# EasyEDA Pro project OURphone_PCB_2026-01-30.epro, board Bachup
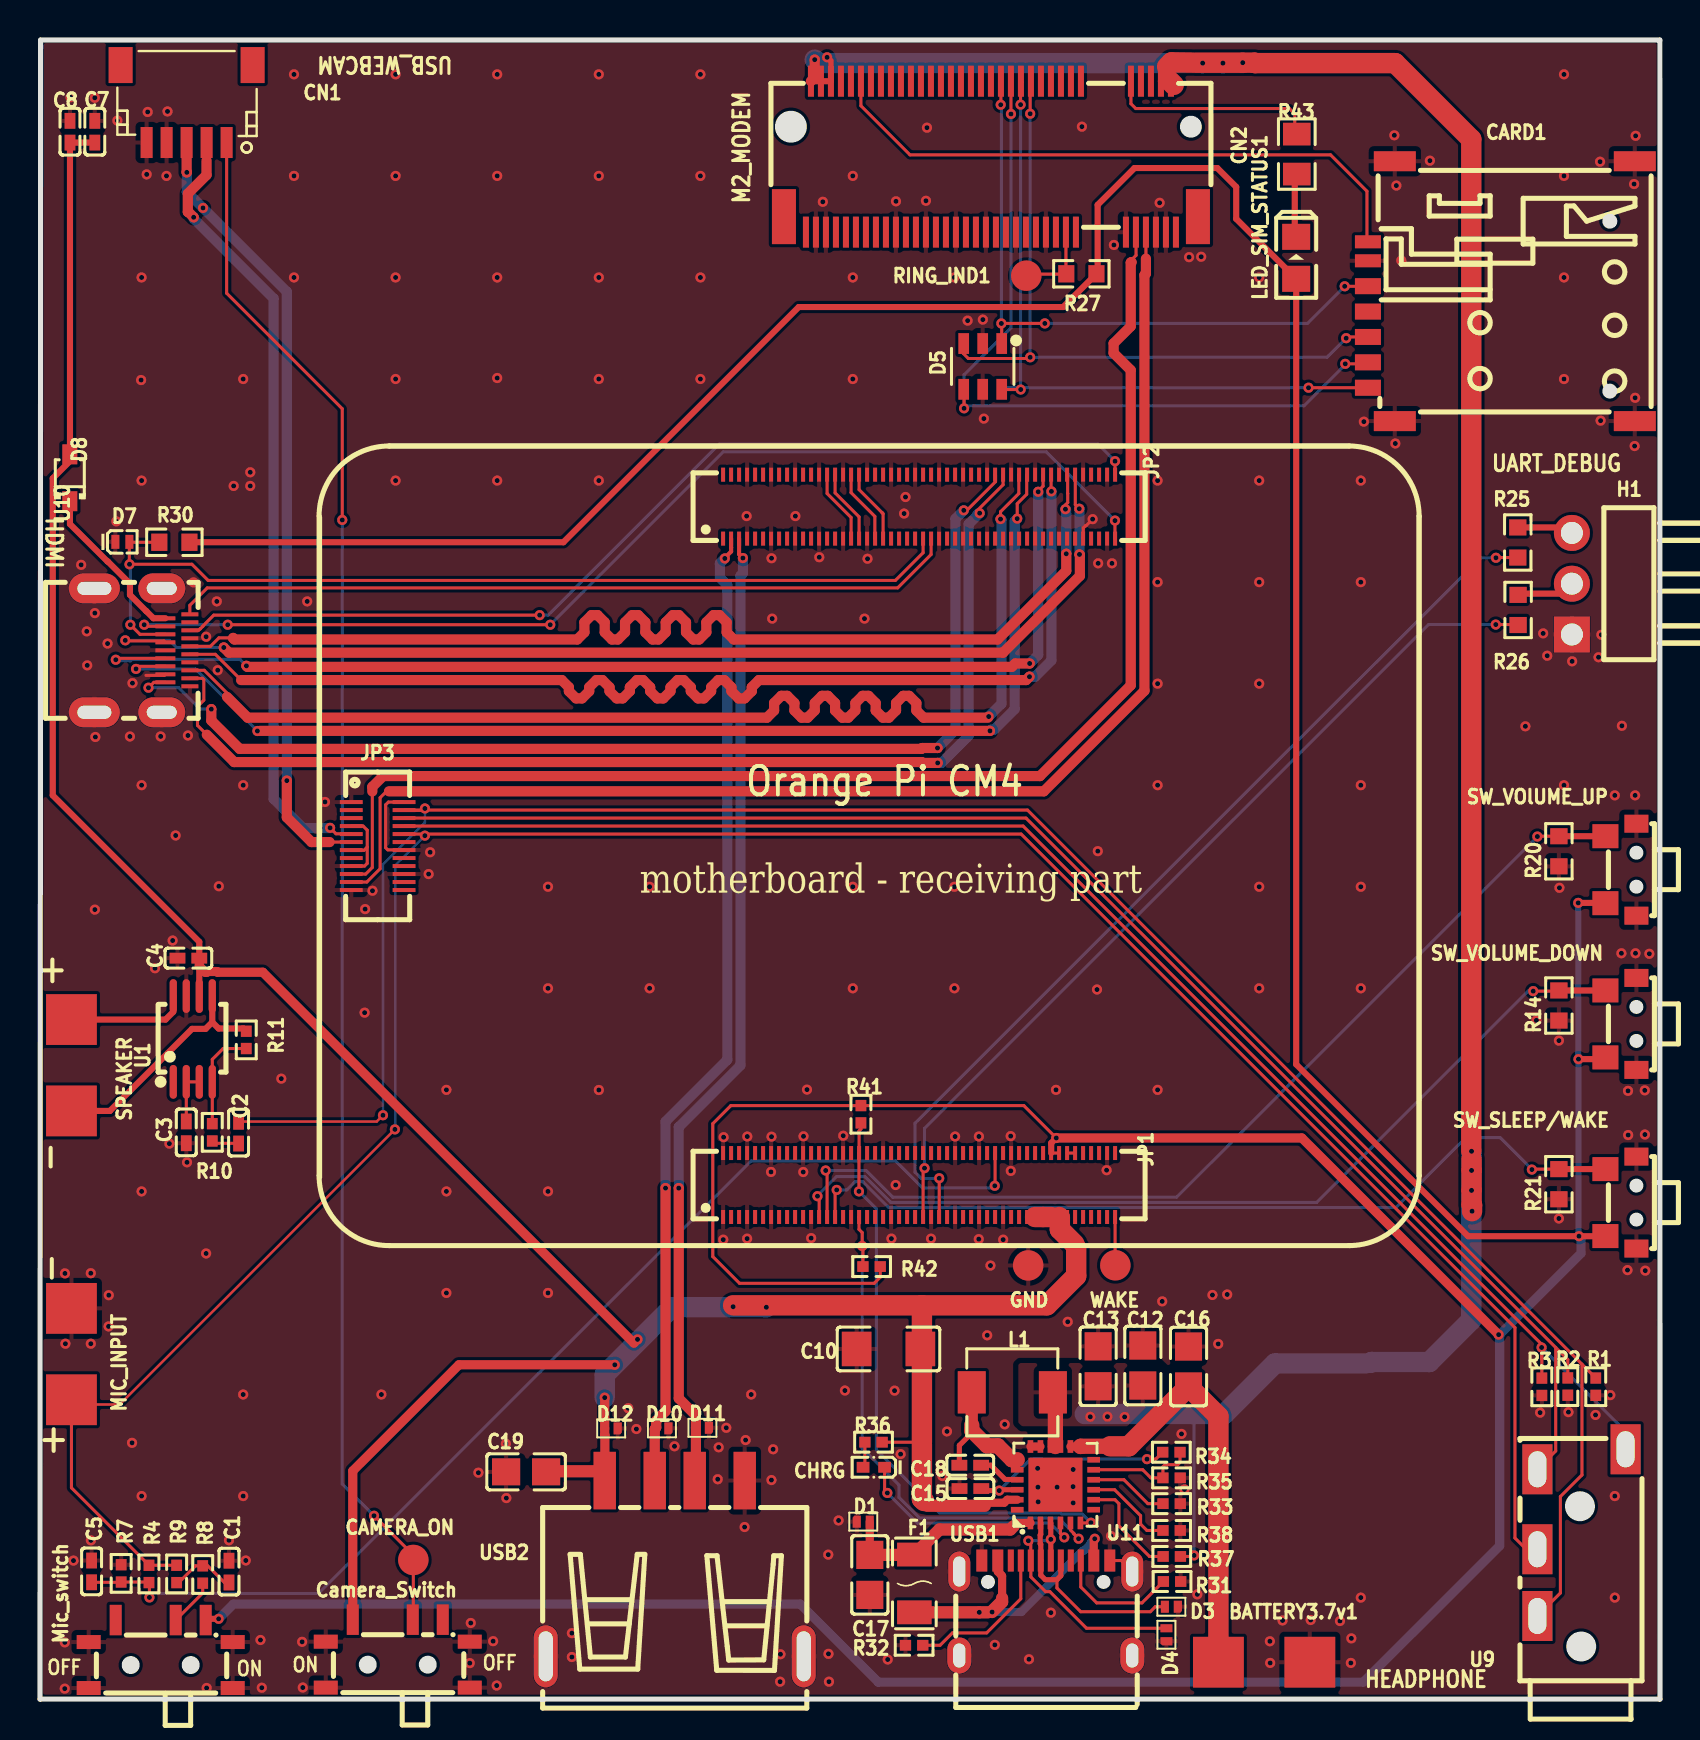
[diagram p6: board, top side]
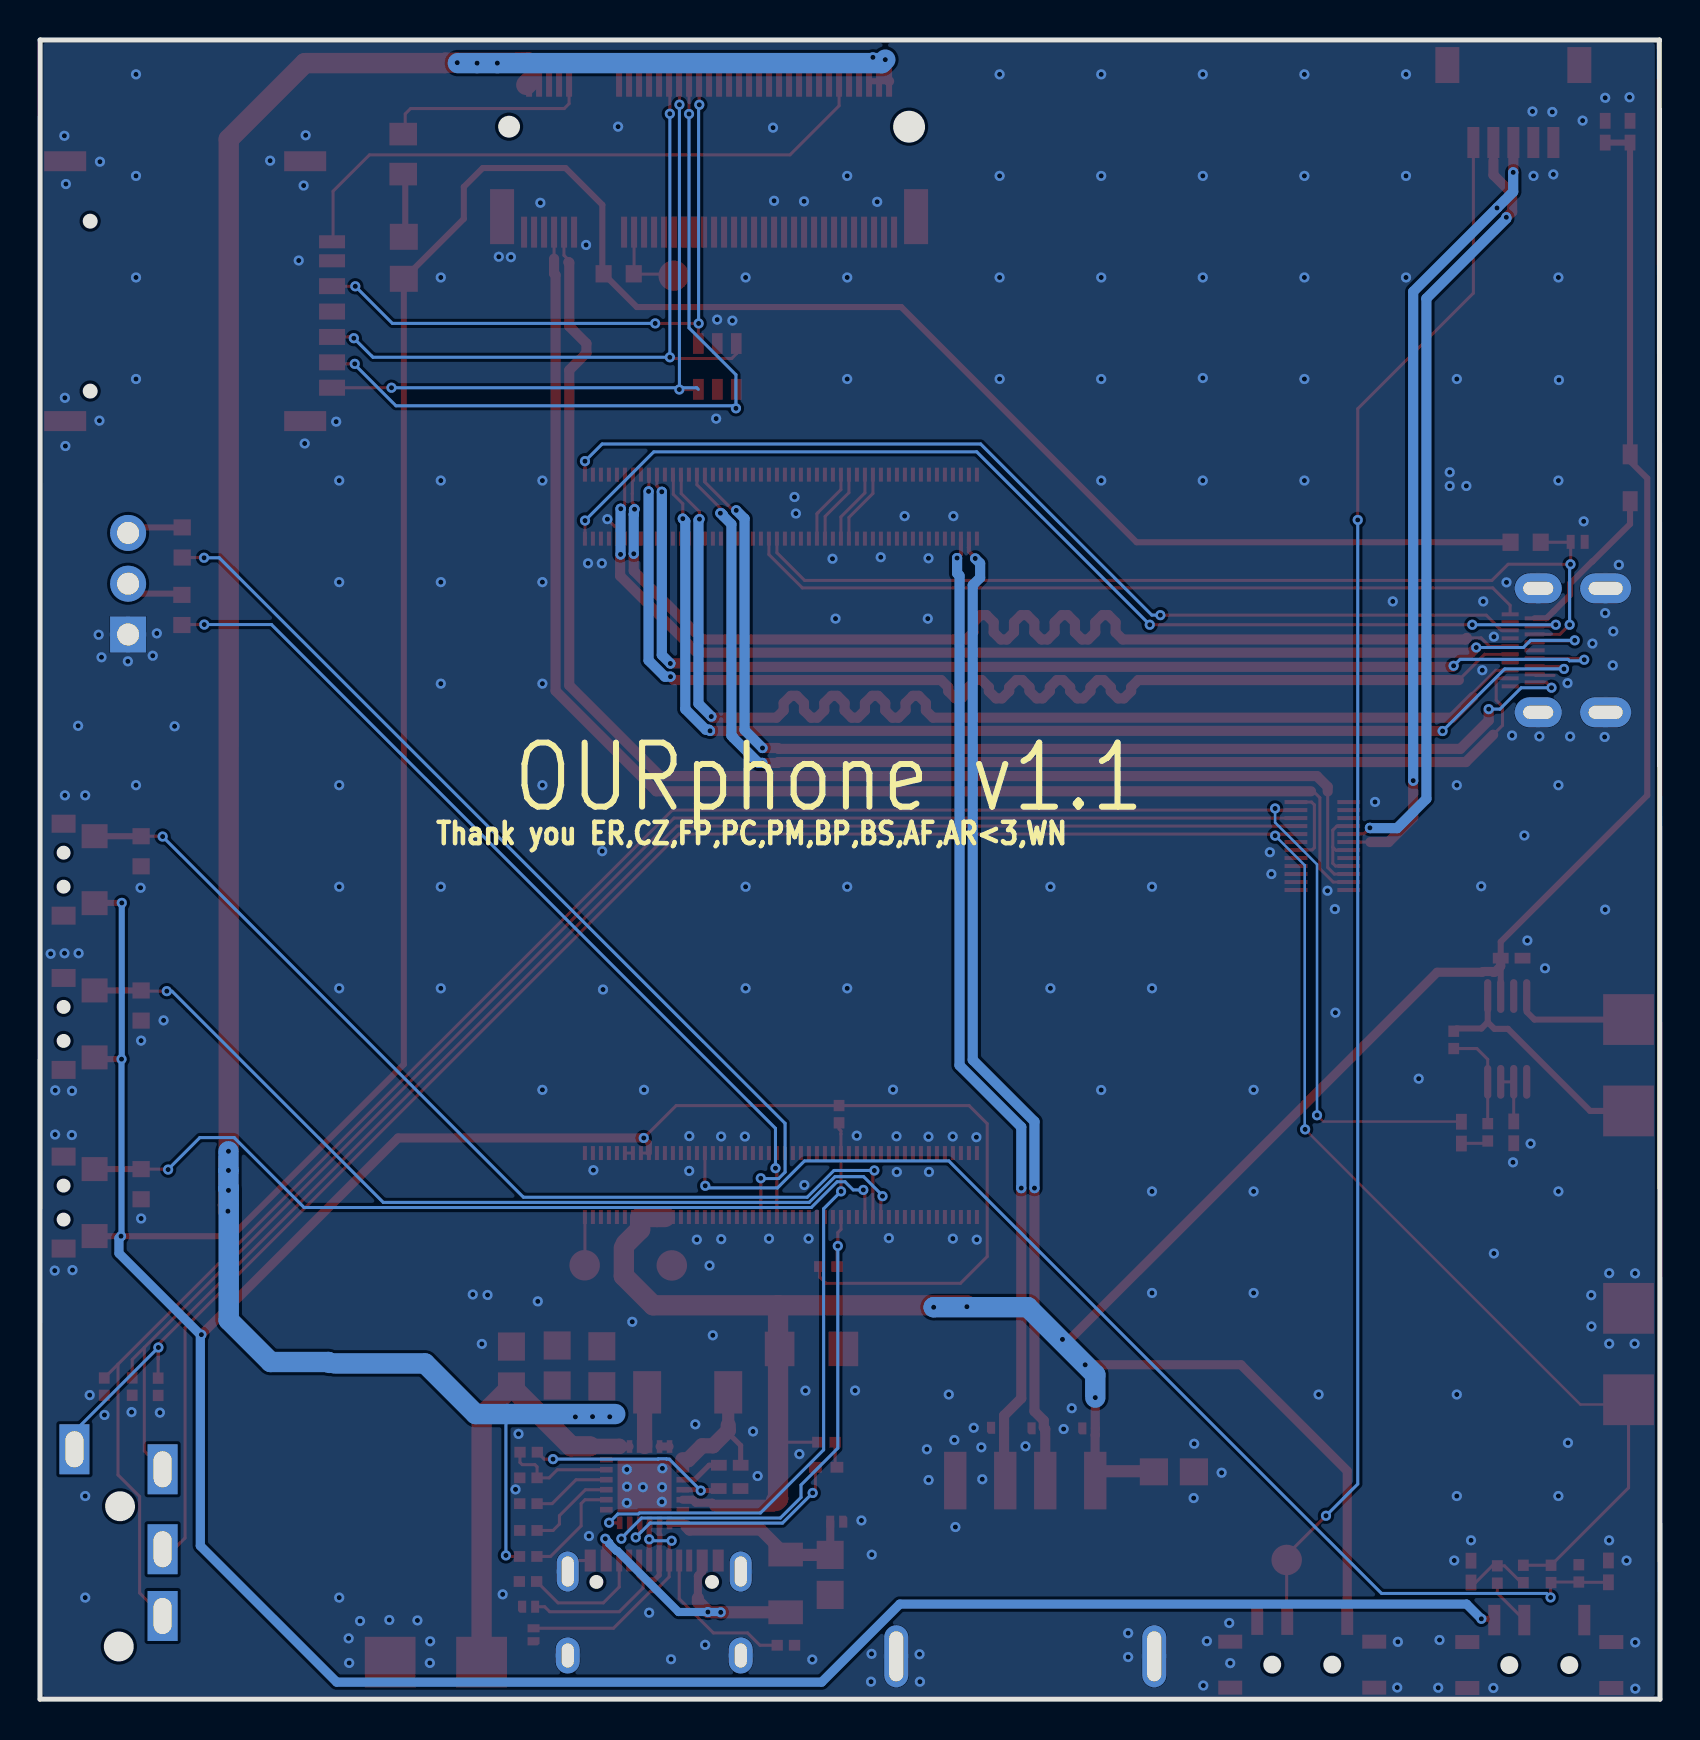
[diagram p7: board, bottom side, seen from below]

Outline 81 x 83 mm; copper layers: Top Layer, Bottom Layer. Coordinates in mm from the lower left corner of the outline.
Outline path: 0,0 0.03,83 80.99,83 81,0 0,0
Stack: Top Layer 0.035mm / Dielectric1 1.51mm FR4 er 4.5 / Bottom Layer 0.035mm

## Design rules (mm)
net USB2_HOST2_P: DP6
net USB2_HOST2_N: DP6
net USB2_DP: USB2_D
net USB2_DN: USB2_D
net HDMI_TX2_P: DP4
net HDMI_TX2_N: DP4
net HDMI_TX1_P: DP3
net HDMI_TX1_N: DP3
net HDMI_TX0_P: DP1
net HDMI_TX0_N: DP1
net HDMI_TXCLK_P: DP2
net HDMI_TXCLK_N: DP2
net USB3_HOST1_P: DP5
net USB3_HOST1_N: DP5
net USB2_HOST3_P: DP7
net USB2_HOST3_N: DP7
net MIPI_CSI_RX_D2N: MIPI_CSI_RX_D2
net MIPI_CSI_RX_D2P: MIPI_CSI_RX_D2
net MIPI_CSI_RX_D3N: MIPI_CSI_RX_D3
net MIPI_CSI_RX_D3P: MIPI_CSI_RX_D3
net USB2_0_OTG_DM: DP8
net USB2_0_OTG_DP: DP8
template: User Custom Config
spacing Default (default): track to track 0.102, other pairs 0 to 0.152
track width Default (default): min 0.051, default 0.152, max 1.27
differential pair Default (default): width min 0.152, default 0.508, max 0.762; gap min 0.152, default 0.152
via Default (default): diameter min 0.178, default 0.762, max 100.025; hole min 0.15, default 0.61, max 59.995
pour e4504 uses copperRegion1

## Placement (name value [footprint] x y rotation side)
BATTERY3.7v1  NOB  [BATTERY SYMBOL]  64.76 0.71 0 top
C1  10uF  [C0402]  9.45 6.38 270 top
C2  390nF  [C0402]  9.93 28.34 270 top
C3  1uF  [C0402]  7.31 28.35 90 top
C4  1uF  [C0402]  7.42 37.07 0 top
C5  100nF  [C0402]  2.58 6.39 270 top
C7  100nF  [C0402]  2.74 78.41 90 top
C8  10uF  [C0402]  1.5 78.41 270 top
C10  100uF  [C1206]  42.43 17.52 0 top
C12  22uF  [C0805]  55.14 16.69 270 top
C13  22uF  [C0805]  52.91 16.65 270 top
C15  10uF  [C0402]  46.52 10.54 0 top
C16  22uF  [C0805]  57.43 16.64 270 top
C17  2.2uF  [C0805]  41.49 6.22 90 top
C18  100nF  [C0402]  46.51 11.7 0 top
C19  2.2uF  [C0805]  24.31 11.37 0 top
CAMERA_ON  TP-橘色测试点  [TESTPOINT-TH_BD3.2]  18.67 6.96 180 top
Camera_Switch  HX MSK12C02-HB  [SW-SMD_MSK12C02-HB]  17.89 2.28 0 top
CARD1  SMN-303  [SIM-SMD_SMN-303]  73.07 70.43 90 top
CHRG  XL-1005UGC  [LED0402-RD_GREEN]  41.69 11.6 180 top
CN1  SM05B-SRSS-TB (LF)(SN)  [CONN-SMD_SM05B-SRSS-TB-LF-SN]  7.33 79.81 180 top
CN2  AS0BC21-S30BB-7H  [CONN-SMD_AS0BC21-S30BB-7H]  47.55 77.16 180 top
D1  AZ5825-01F  [DFN-2L_L1.0-W0.6-P0.65-BI]  41.16 8.88 0 top
D3  AZ5825-01F  [DFN-2L_L1.0-W0.6-P0.65-BI]  56.57 4.62 180 top
D4  AZ5825-01F  [DFN-2L_L1.0-W0.6-P0.65-BI]  56.32 3.22 90 top
D5  DT1042-04SO-7  [SOT-26_L3.0-W1.6-P0.95-LS2.8-BL]  47.14 66.67 180 top
D7  PESD5V0S1UL,315  [SOD-882_L1.0-W0.6-RD]  4.12 57.89 0 top
D8  1N5819WS  [SOD-323_L1.8-W1.3-LS2.5-RD]  1.49 61.1 90 top
D10  AZ5825-01F  [DFN-2L_L1.0-W0.6-P0.65-BI]  31.1 13.55 180 top
D11  AZ5825-01F  [DFN-2L_L1.0-W0.6-P0.65-BI]  33.12 13.57 180 top
D12  AZ5825-01F  [DFN-2L_L1.0-W0.6-P0.65-BI]  28.56 13.54 180 top
F1  SMD1206P250TF  [F1206]  43.72 5.79 90 top
GND  TP-橘色测试点  [TESTPOINT-TH_BD3.2]  49.41 21.7 0 top
H1  PZ254R-11-03P  [HDR-TH_3P-P2.54-H-M-W10.4]  76.59 55.8 90 top
JP1  DF40C-100DS-0.4V(51)  [CONN-SMD_DF40C-100DS-0.4V-51]  43.95 25.72 180 top
JP2  DF40C-100DS-0.4V(51)  [CONN-SMD_DF40C-100DS-0.4V-51]  43.95 59.66 180 top
JP3  DF40C-24DS-0.4V(51)  [CONN-SMD_DF40C-24DS-0.4V51]  16.88 42.68 90 top
L1  2.2uH  [IND-SMD_L4.4-W4.2]  48.62 15.35 180 top
LED_SIM_STATUS1  LED-0805_B  [LED0805_BLUE]  62.81 72.1 90 top
MIC_INPUT  NOB  [BATTERY SYMBOL]  2.72 20.82 90 top
Mic_switch  HX MSK12C02-HB  [SW-SMD_MSK12C02-HB]  6.03 2.26 0 top
R1  470Ω  [R0402]  77.79 15.63 90 top
R2  470Ω  [R0402]  76.39 15.64 90 top
R3  0Ω  [R0402]  75.09 15.63 90 top
R4  100kΩ  [R0402]  5.45 6.26 270 top
R7  100kΩ  [R0402]  4.06 6.29 270 top
R8  22Ω  [R0402]  8.14 6.24 270 top
R9  2.2kΩ  [R0402]  6.83 6.26 270 top
R10  20kΩ  [R0402]  8.61 28.35 90 top
R11  20kΩ  [R0402]  10.31 32.98 270 top
R14  10K  [R0603]  75.94 34.7 90 top
R20  10K  [R0603]  75.94 42.42 90 top
R21  10K  [R0603]  75.94 25.76 90 top
R25  1kΩ  [R0603]  73.89 57.86 90 top
R26  1kΩ  [R0603]  73.9 54.49 90 top
R27  10K  [R0603]  52.07 71.3 180 top
R30  10K  [R0603]  6.72 57.87 0 top
R31  5.1kΩ  [R0402]  56.6 5.88 180 top
R32  5.1kΩ  [R0402]  43.71 2.69 0 top
R33  270Ω  [R0402]  56.58 9.78 180 top
R34  10kΩ  [R0402]  56.57 12.35 180 top
R35  10kΩ  [R0402]  56.58 11.07 180 top
R36  2.2kΩ  [R0402]  41.68 12.85 0 top
R37  10kΩ  [R0402]  56.59 7.14 180 top
R38  100kΩ  [R0402]  56.58 8.44 0 top
R41  10kΩ  [R0402]  41.05 29.26 90 top
R42  10kΩ  [R0402]  41.58 21.64 0 top
R43  330Ω  [R0805]  62.84 77.29 270 top
RING_IND1  TP-橘色测试点  [TESTPOINT-TH_BD3.2]  49.31 71.21 180 top
SPEAKER  NOB  [BATTERY SYMBOL]  0.43 28.16 270 top
SW_SLEEP/WAKE  TS24CA  [SW-SMD_TS24CA]  79.05 24.84 270 top
SW_VOLUME_DOWN  TS24CA  [SW-SMD_TS24CA]  79.05 33.78 270 top
SW_VOlUME_UP  TS24CA  [SW-SMD_TS24CA]  79.05 41.49 270 top
U1  LM4990MM/NOPB  [MSOP-8_L3.0-W3.0-P0.65-LS5.0-BL]  7.64 33.03 0 top
U9  PJ-3200B-4A  [AUDIO-TH_PJ-3200B-4A]  77.07 8.33 90 top
U10  GT-HD004A-PNNG0  [HDMI-SMD_GT-HD004A-FNNG0]  5.11 52.47 270 top
U11  BQ25895RTWR  [QFN-24_L4.0-W4.0-P0.50-TL-EP2.7]  50.77 10.73 90 top
USB1  TYPE-C 16PIN 2MD(073)  [USB-C-SMD_TYPE-C-6PIN-2MD-073]  50.29 4.56 0 top
USB2  10.0 QHHTZB6.3  [USB-A-TH_10.0QHHTZB6.3]  31.74 6.54 0 top
WAKE  TP-橘色测试点  [TESTPOINT-TH_BD3.2]  53.77 21.7 0 top

## Footprints (pads in the part's own frame, mm; a bottom-side part is the same pattern mirrored in y, then rotated)
AUDIO-TH_PJ-3200B-4A
  rect 2.5x1.5 hole 1.8x0.9: 1(4.17,-2.204) 2(3.17,2.204) 3(-4.17,2.204) 4(-0.831,2.204)
BATTERY SYMBOL
  rect 2.54x2.54 smd: 1(-5.842,1.143) 2(-1.27,1.143)
C0402
  rect 0.79x0.54 smd: 1(-0.545,0) 2(0.545,0)
C0805
  rect 1.41x1.35 smd: 1(-1,0) 2(1,0)
C1206
  rect 1.485x1.728 smd: 1(-1.593,0) 2(1.593,0)
CONN-SMD_AS0BC21-S30BB-7H
  rect 0.3x1.55 smd: 1(-9.25,3.775) 2(-9,-3.775) 3(-8.75,3.775) 4(-8.5,-3.775) 5(-8.25,3.775) 6(-8,-3.775) 7(-7.75,3.775) 8(-7.5,-3.775) 9(-7.25,3.775) 10(-7,-3.775) 11(-6.75,3.775) 20(-4.5,-3.775) 21(-4.25,3.775) 22(-4,-3.775) 23(-3.75,3.775) 24(-3.5,-3.775) 25(-3.25,3.775) 26(-3,-3.775) 27(-2.75,3.775) 28(-2.5,-3.775) 29(-2.25,3.775) 30(-2,-3.775) 31(-1.75,3.775) 32(-1.5,-3.775) 33(-1.25,3.775) 34(-1,-3.775) 35(-0.75,3.775) 36(-0.5,-3.775) 37(-0.25,3.775) 38(0,-3.775) 39(0.25,3.775) 40(0.5,-3.775) 41(0.75,3.775) 42(1,-3.775) 43(1.25,3.775) 44(1.5,-3.775) 45(1.75,3.775) 46(2,-3.775) 47(2.25,3.775) 48(2.5,-3.775) 49(2.75,3.775) 50(3,-3.775) 51(3.25,3.775) 52(3.5,-3.775) 53(3.75,3.775) 54(4,-3.775) 55(4.25,3.775) 56(4.5,-3.775) 57(4.75,3.775) 58(5,-3.775) 59(5.25,3.775) 60(5.5,-3.775) 61(5.75,3.775) 62(6,-3.775) 63(6.25,3.775) 64(6.5,-3.775) 65(6.75,3.775) 66(7,-3.775) 67(7.25,3.775) 68(7.5,-3.775) 69(7.75,3.775) 70(8,-3.775) 71(8.25,3.775) 72(8.5,-3.775) 73(8.75,3.775) 74(9,-3.775) 75(9.25,3.775)
  rect 1.2x2.75 smd: 76(10.35,3) 77(-10.35,3)
CONN-SMD_DF40C-24DS-0.4V51
  rect 0.2x1.14 smd: 1(2.2,1.32) 2(2.2,-1.32) 3(1.8,1.32) 4(1.8,-1.32) 5(1.4,1.32) 6(1.4,-1.32) 7(1,1.32) 8(1,-1.32) 9(0.6,1.32) 10(0.6,-1.32) 11(0.2,1.32) 12(0.2,-1.32) 13(-0.2,1.32) 14(-0.2,-1.32) 15(-0.6,1.32) 16(-0.6,-1.32) 17(-1,1.32) 18(-1,-1.32) 19(-1.4,1.32) 20(-1.4,-1.32) 21(-1.8,1.32) 22(-1.8,-1.32) 23(-2.2,1.32) 24(-2.2,-1.32)
CONN-SMD_DF40C-100DS-0.4V-51
  rect 0.2x0.7 smd: 1(9.8,1.6) 2(9.8,-1.6) 3(9.4,1.6) 4(9.4,-1.6) 5(9,1.6) 6(9,-1.6) 7(8.6,1.6) 8(8.6,-1.6) 9(8.2,1.6) 10(8.2,-1.6) 11(7.8,1.6) 12(7.8,-1.6) 13(7.4,1.6) 14(7.4,-1.6) 15(7,1.6) 16(7,-1.6) 17(6.6,1.6) 18(6.6,-1.6) 19(6.2,1.6) 20(6.2,-1.6) 21(5.8,1.6) 22(5.8,-1.6) 23(5.4,1.6) 24(5.4,-1.6) 25(5,1.6) 26(5,-1.6) 27(4.6,1.6) 28(4.6,-1.6) 29(4.2,1.6) 30(4.2,-1.6) 31(3.8,1.6) 32(3.8,-1.6) 33(3.4,1.6) 34(3.4,-1.6) 35(3,1.6) 36(3,-1.6) 37(2.6,1.6) 38(2.6,-1.6) 39(2.2,1.6) 40(2.2,-1.6) 41(1.8,1.6) 42(1.8,-1.6) 43(1.4,1.6) 44(1.4,-1.6) 45(1,1.6) 46(1,-1.6) 47(0.6,1.6) 48(0.6,-1.6) 49(0.2,1.6) 50(0.2,-1.6) 51(-0.2,1.6) 52(-0.2,-1.6) 53(-0.6,1.6) 54(-0.6,-1.6) 55(-1,1.6) 56(-1,-1.6) 57(-1.4,1.6) 58(-1.4,-1.6) 59(-1.8,1.6) 60(-1.8,-1.6) 61(-2.2,1.6) 62(-2.2,-1.6) 63(-2.6,1.6) 64(-2.6,-1.6) 65(-3,1.6) 66(-3,-1.6) 67(-3.4,1.6) 68(-3.4,-1.6) 69(-3.8,1.6) 70(-3.8,-1.6) 71(-4.2,1.6) 72(-4.2,-1.6) 73(-4.6,1.6) 74(-4.6,-1.6) 75(-5,1.6) 76(-5,-1.6) 77(-5.4,1.6) 78(-5.4,-1.6) 79(-5.8,1.6) 80(-5.8,-1.6) 81(-6.2,1.6) 82(-6.2,-1.6) 83(-6.6,1.6) 84(-6.6,-1.6) 85(-7,1.6) 86(-7,-1.6) 87(-7.4,1.6) 88(-7.4,-1.6) 89(-7.8,1.6) 90(-7.8,-1.6) 91(-8.2,1.6) 92(-8.2,-1.6) 93(-8.6,1.6) 94(-8.6,-1.6) 95(-9,1.6) 96(-9,-1.6) 97(-9.4,1.6) 98(-9.4,-1.6) 99(-9.8,1.6) 100(-9.8,-1.6)
CONN-SMD_SM05B-SRSS-TB-LF-SN
  rect 0.6x1.55 smd: 1(-2,1.938) 2(-0.999,1.938) 3(0.001,1.938) 4(1,1.938) 5(2.001,1.938)
  rect 1.2x1.8 smd: 6(-3.3,-1.938) 7(3.3,-1.938)
DFN-2L_L1.0-W0.6-P0.65-BI
  custom 0.41x0.6 smd: 1(-0.325,0)
  rect 0.4x0.6 smd: 2(0.325,0)
F1206
  rect 1.19x1.728 smd: 1(-1.445,0) 2(1.445,0)
HDMI-SMD_GT-HD004A-FNNG0
  rect 0.2x0.85 smd: 1(1.8,2.388) 3(1.4,2.388) 5(1,2.388) 7(0.6,2.388) 9(0.2,2.388) 11(-0.2,2.388) 13(-0.6,2.388) 15(-1,2.388) 17(-1.4,2.388) 19(-1.8,2.388)
  rect 0.2x1 smd: 2(1.6,1.163) 4(1.2,1.163) 6(0.8,1.163) 8(0.4,1.163) 10(0,1.163) 12(-0.4,1.163) 14(-0.8,1.163) 16(-1.2,1.163) 18(-1.6,1.163)
  oval 1.5x2.35 hole 0.65x1.5: 20(-3.1,0.983) 20(3.1,0.983)
  oval 1.5x2.55 hole 0.65x1.7: 21(-3.1,-2.388) 21(3.1,-2.388)
HDR-TH_3P-P2.54-H-M-W10.4
  rect 1.8x1.8 hole 1.1: 1(-2.54,0)
  round 1.8 hole 1.1: 2(0,0) 3(2.54,0)
IND-SMD_L4.4-W4.2
  rect 1.4x2.12 smd: 1(2.028,0) 2(-2.028,0)
LED0402-RD_GREEN
  rect 0.636x0.54 smd: 1(-0.538,0) 2(0.538,0)
LED0805_BLUE
  rect 1.3x1.399 smd: 1(-1.05,0) 2(1.05,0)
MSOP-8_L3.0-W3.0-P0.65-LS5.0-BL
  oval 0.364x1.692 smd: 1(-0.975,-2.146) 2(-0.325,-2.146) 3(0.325,-2.146) 4(0.975,-2.146) 5(0.975,2.146) 6(0.325,2.146) 7(-0.325,2.146) 8(-0.975,2.146)
QFN-24_L4.0-W4.0-P0.50-TL-EP2.7
  rect 0.633x0.28 smd: 1(-1.911,1.25) 2(-1.911,0.75) 3(-1.911,0.25) 4(-1.911,-0.25) 5(-1.911,-0.75) 6(-1.911,-1.25) 13(1.911,-1.25) 14(1.911,-0.75) 15(1.911,-0.25) 16(1.911,0.25) 17(1.911,0.75) 18(1.911,1.25)
  rect 0.28x0.633 smd: 7(-1.25,-1.911) 8(-0.75,-1.911) 9(-0.25,-1.911) 10(0.25,-1.911) 11(0.75,-1.911) 12(1.25,-1.911) 19(1.25,1.911) 20(0.75,1.911) 21(0.25,1.911) 22(-0.25,1.911) 23(-0.75,1.911) 24(-1.25,1.911)
  rect 2.7x2.7 smd: 25(0,0)
R0402
  rect 0.566x0.54 smd: 1(-0.433,0) 2(0.433,0)
R0603
  rect 0.806x0.864 smd: 1(-0.753,0) 2(0.753,0)
R0805
  rect 1.133x1.377 smd: 1(-1,0) 2(1,0)
SIM-SMD_SMN-303
  rect 1x2.1 smd: 8(-6.5,5.328) 9(6.5,5.328) 10(6.5,-6.672) 11(-6.5,-6.672)
  rect 0.8x1.3 smd: C1(0.25,6.672) C2(-2.29,6.672) C3(-4.83,6.672) C6(-1.02,6.672) C7(-3.56,6.672)
  rect 0.65x1.3 smd: C5(1.52,6.672) CD(2.47,6.672)
SOD-323_L1.8-W1.3-LS2.5-RD
  rect 1x0.75 smd: 1(-1.173,0) 2(1.173,0)
SOD-882_L1.0-W0.6-RD
  rect 0.4x0.7 smd: 1(-0.35,0) 2(0.35,0)
SOT-26_L3.0-W1.6-P0.95-LS2.8-BL
  rect 0.532x1.04 smd: 1(-0.95,-1.145) 2(0,-1.145) 3(0.95,-1.145) 4(0.95,1.145) 5(0,1.145) 6(-0.95,1.145)
SW-SMD_MSK12C02-HB
  rect 0.6x1.524 smd: 1(-2.25,1.7) 2(0.75,1.7) 3(2.25,1.7)
  rect 1.2x0.7 smd: 4(-3.6,0.6) 4(-3.6,-1.7) 4(3.6,0.6) 4(3.6,-1.7)
SW-SMD_TS24CA
  rect 0.9x1.2 smd: 1(-2.3,0.775) 2(2.3,0.775)
  rect 1.2x1.3 smd: 3(-1.675,-0.775) 4(1.675,-0.775)
TESTPOINT-TH_BD3.2
  round 1.524 smd: 1(0,0)
USB-A-TH_10.0QHHTZB6.3
  rect 1.12x2.88 smd: 1(-3.5,4.395) 2(-1,4.395) 3(1,4.395) 4(3.5,4.395)
  oval 1.2x3.1 hole 0.7x2.5: 5(-6.45,-4.395) 6(6.45,-4.395)
USB-C-SMD_TYPE-C-6PIN-2MD-073
  rect 0.55x1.1 smd: 1(-3.2,2.375) 2(-2.4,2.375) 11(2.4,2.375) 12(3.2,2.375)
  rect 0.3x1.1 smd: 3(-1.75,2.375) 4(-1.25,2.375) 5(-0.75,2.375) 6(-0.25,2.375) 7(0.25,2.375) 8(0.75,2.375) 9(1.25,2.375) 10(1.75,2.375)
  oval 1.1x2 hole 0.6x1.5: 13(-4.325,1.825) 14(4.325,1.825)
  oval 1.2x1.8 hole 0.6x1.2: 13(-4.325,-2.375) 14(4.325,-2.375)

## Nets
+5V: C4.2 C7.1 C8.2 C10.2 C19.2 Camera_Switch.1 D8.2 D12.2 JP1.77 JP1.79 JP1.81 JP1.83 JP1.85 JP1.87 R36.2 U1.6 U11.23 USB2.1
GND: BATTERY3.7v1.2 C1.1 C3.1 C4.1 C5.1 C7.2 C8.1 C10.1 C12.1 C13.1 C15.1 C16.1 C17.1 C19.1 Camera_Switch.4 CARD1.8 CARD1.9 CARD1.10 CARD1.11 CARD1.C5 CN1.4 CN1.5 CN2.3 CN2.5 CN2.11 CN2.27 CN2.33 CN2.39 CN2.45 CN2.51 CN2.57 CN2.71 CN2.73 D1.1 D3.1 D4.1 D5.2 D5.5 D7.1 D10.1 D11.1 D12.1 GND.1 H1.1 JP1.1 JP1.2 JP1.7 JP1.8 JP1.13 JP1.14 JP1.22 JP1.23 JP1.32 JP1.33 JP1.42 JP1.43 JP1.52 JP1.53 JP1.59 JP1.60 JP1.65 JP1.66 JP1.71 JP1.74 JP1.98 JP2.7 JP2.8 JP2.13 JP2.14 JP2.19 JP2.20 JP2.25 JP2.26 JP2.31 JP2.32 JP2.37 JP2.38 JP2.44 JP2.50 JP2.55 JP2.56 JP2.61 JP2.62 JP2.67 JP2.68 JP2.73 JP2.74 JP2.79 JP2.80 JP2.85 JP2.86 JP2.91 JP2.92 JP2.97 JP2.98 JP3.1 JP3.2 JP3.7 JP3.13 JP3.14 JP3.17 JP3.20 JP3.23 MIC_INPUT.2 Mic_switch.4 R1.1 R2.1 R3.1 R7.1 R14.1 R20.1 R21.1 R31.1 R32.1 R33.1 R35.1 R38.2 SW_SLEEP/WAKE.1 SW_SLEEP/WAKE.2 SW_VOLUME_DOWN.1 SW_VOLUME_DOWN.2 SW_VOlUME_UP.1 SW_VOlUME_UP.2 U1.7 U10.1 U10.4 U10.7 U10.10 U10.13 U10.20 U10.21 U11.17 U11.18 U11.25 USB1.1 USB1.12 USB1.13 USB1.14 USB2.4 USB2.5 USB2.6
VBAT: BATTERY3.7v1.1 C16.2 U11.13 U11.14
VCC_1V8: JP1.88 JP1.90
VCC_3V3: JP1.84 JP1.86 LED_SIM_STATUS1.1 Mic_switch.3 R27.1 R30.2 R41.2 R42.2 SW_SLEEP/WAKE.4 SW_VOLUME_DOWN.4 SW_VOlUME_UP.4
BTST: C18.2 U11.21
CARD_DETECT: CARD1.CD CN2.64
CE: R38.1 U11.9
GPIO0_D0(UART2_RX_M0): JP1.51 R26.1
GPIO0_D1(UART2_TX_M0): JP1.55 R25.1
GPIO3_D1: JP1.25 R14.2 SW_VOLUME_DOWN.3
GPIO3_D2: JP1.27 R20.2 SW_VOlUME_UP.3
GPIO3_D5: JP1.29 R21.2 SW_SLEEP/WAKE.3
HDMI_CEC_PORT: D7.2 JP2.51 R30.1 U10.14
HDMI_TX0_N: JP2.84 U10.9
HDMI_TX0_P: JP2.82 U10.8
HDMI_TX1_N: JP2.78 U10.6
HDMI_TX1_P: JP2.76 U10.5
HDMI_TX2_N: JP2.72 U10.3
HDMI_TX2_P: JP2.70 U10.2
HDMI_TX_HPD_PORT: JP2.53 U10.19
HDMI_TXCLK_N: JP2.90 U10.12
HDMI_TXCLK_P: JP2.88 U10.11
HDMI_TXDDC_SCL_PORT: JP2.100 U10.15
HDMI_TXDDC_SDA_PORT: JP2.99 U10.16
HP_SNS: JP3.8 R3.2 U9.1
HPL_OUT: JP3.6 R2.2 U9.2
HPR_OUT: C2.1 JP3.4 R1.2 U9.3
ILIM: R33.2 U11.10
LED1#: CN2.10 R43.1
MIC1_IN: JP3.10 MIC_INPUT.1 R4.1 R9.1 U9.4
MIPI_CSI_RX_D2N: JP2.28 JP2.33
MIPI_CSI_RX_D2P: JP2.30 JP2.35
MIPI_CSI_RX_D3N: JP2.34 JP2.39
MIPI_CSI_RX_D3P: JP2.36 JP2.41
OTG: R37.2 U11.8
PMIC_PWRON: JP1.99 WAKE.1
REGN: C15.2 R34.2 U11.22
SARADC_VIN1: C5.2 JP1.70 R4.2 R7.2
SCL: JP1.35 R42.1 U11.5
SDA: JP1.36 R41.1 U11.6
SPEAKER+: SPEAKER.1 U1.8
SPEAKER-: R11.1 SPEAKER.2 U1.5
STATUS: CHRG.1 U11.4
SW: C18.1 L1.1 U11.19 U11.20
SYS: C12.2 C13.2 CN2.2 CN2.4 CN2.70 CN2.72 CN2.74 L1.2 R37.1 U11.15 U11.16
TS: R34.1 R35.2 U11.11
USB2_0_OTG_DM: D10.2 JP2.3 USB2.2
USB2_0_OTG_DP: D11.2 JP2.5 USB2.3
USB2_DN: D4.2 U11.3 USB1.5 USB1.7
USB2_DP: D3.2 U11.2 USB1.6 USB1.8
USB2_HOST2_N: CN1.2 JP3.9
USB2_HOST2_P: CN1.3 JP3.11
USB2_HOST3_N: JP3.3
USB2_HOST3_P: JP3.5
USB3_HOST1_N: CN2.9 JP3.19
USB3_HOST1_P: CN2.7 JP3.21
USIM_CLK: CARD1.C3 CN2.32 D5.6
USIM_DATA: CARD1.C7 CN2.34 D5.4
USIM_RST: CARD1.C2 CN2.30 D5.3
USIM_VDD: CARD1.C1 CN2.36 D5.1
V_USB: C17.2 D1.2 F1.2 U11.1
$1N4419: H1.3 R25.2
$1N4460: H1.2 R26.2
$2N2: CAMERA_ON.1 Camera_Switch.2 CN1.1
$2N7: C3.2 U1.2 U1.3
$2N10: R10.2 R11.2 U1.4
$2N12: C1.2 R8.1 R9.2
$2N528: C2.2 R10.1
$2N1557: Mic_switch.2 R8.2
$3N6118: CN2.23 R27.2 RING_IND1.1
$3N9431: LED_SIM_STATUS1.2 R43.2
$5N5817: D8.1 U10.18
$6N34185: CHRG.2 R36.1
$6N55425: F1.1 USB1.2 USB1.11
$6N55448: R32.2 USB1.4
$6N55522: R31.2 USB1.10

Pads without a net: Camera_Switch 3; CARD1 C6; CN1 6 7; CN2 1 6 8 20 21 22 24 25 26 28 29 31 35 37 38 40 41 42 43 44 46 47 48 49 50 52 53 54 55 56 58 59 60 61 62 63 65 66 67 68 69 75 76 77; JP1 3 4 5 6 9 10 11 12 15 16 17 18 19 20 21 24 26 28 30 31 34 37 38 39 40 41 44 45 46 47 48 49 50 54 56 57 58 61 62 63 64 67 68 69 72 73 75 76 78 80 82 89 91 92 93 94 95 96 97 100; JP2 1 2 4 6 9 10 11 12 15 16 17 18 21 22 23 24 27 29 40 42 43 45 46 47 48 49 52 54 57 58 59 60 63 64 65 66 69 71 75 77 81 83 87 89 93 94 95 96; JP3 12 15 16 18 22 24; Mic_switch 1; U1 1; U10 17; U11 7 12 24; USB1 3 9

## Via types
v1: diameter 0.508, hole 0.254, Top Layer to Bottom Layer, 391 vias

## Routing (per net, layer and track width the routed paths; a pad name or vN(x,y) marks a point on that pad's centre or on a via; arc(x,y) is an arc through that point)
+5V: length 156.6
  Top Layer w0.152: 42.11,12.85 44.2,12.85 44.32,12.74 ; JP1.87 JP1.85
  Top Layer w0.305: U1.6 7.96,36.67 ; D8.2 1.49,61.92 0.64,61.07 0.64,45.21 7.96,37.89 C4.2 ; C7.1 C8.2 1.5,62.44 ; 1.41,62.35 1.34,62.28
  Top Layer w0.406: U11.23 48.36,9.98 48.21,9.83 47.39,9.83 47.24,9.67
  Top Layer w0.457: Camera_Switch.1 15.64,11.42 20.95,16.73 v1(28.74,16.73) ; v1(28.24,15.09) D12.2 28.24,13.21 28.24,13.2 28.24,10.94 USB2.1 ; C4.2 7.96,36.67 8.27,36.36 8.34,36.36 8.38,36.4 8.85,36.4 8.88,36.36 11.14,36.36 29.69,17.81 v1(29.88,18)
  Top Layer w0.61: 47.24,9.67 44.36,9.67 ; USB2.1 28.24,11.37 28.21,11.4 25.38,11.4 25.35,11.37 C19.2
  Top Layer w1.016: JP1.83 JP1.81 JP1.79 ; 51.71,22.78 50.99,23.5 50.99,24.08 JP1.85 ; 44.1,12.85 44.1,19.7 ; 44.1,19.7 34.66,19.7 ; 44.1,19.7 50.34,19.7 51.81,21.17 51.81,22.58 ; 44.2,9.91 44.1,10.02 44.1,12.74
  Bottom Layer w1.016: v1(36.32,19.6) 36.31,19.61 31.61,19.61 28.24,16.23 v1(28.24,15.09)
  vias: v1(34.66,19.63)
GND: length 12.4
  Top Layer w0.152: JP3.7 16.16,43.68 16.36,43.47 16.36,42.63 ; JP3.13 15.58,42.46 16.2,42.46 16.36,42.63 ; U10.4 6.21,51.21 5.3,51.21 ; JP3.2 17.42,44.88 17.28,44.74 17.28,42.59 17.39,42.49 18.19,42.49 JP3.14 ; JP3.17 16.23,41.68 16.36,41.81 16.36,42.63 ; USB1.14 54.06,6.93 USB1.12 ; v1(52.63,59.03) 52.3,58.7 52.27,58.7 52.17,58.59 52.17,58.07 JP2.91
  Top Layer w0.406: U11.17 U11.18
  vias: v1(1.25,21.3) v1(1.24,2.84) v1(1.24,0.53) v1(1.27,17.78) v1(1.52,80.14) v1(1.67,6.93) v1(2.06,56.74) v1(2.34,53.42) v1(2.36,51.71) v1(2.54,21.31) v1(2.54,17.78) v1(2.55,7.94) v1(2.74,80.11) v1(2.74,54.33) v1(2.74,39.5) v1(2.77,48.13) v1(3.38,52.81) v1(3.44,20.21) v1(3.43,18.65) v1(3.82,58.92) v1(3.87,78.97) v1(4.5,48.16) v1(4.62,50.83) v1(4.6,12.82) v1(5.08,71.12) v1(5.05,65.99) v1(5.08,60.96) v1(5.08,45.72) v1(5.08,25.4) v1(5.08,10.16) v1(5.33,76.28) v1(5.39,79.4) v1(5.75,36.56) v1(6.03,48.16) v1(6.32,76.2) v1(6.38,79.43) v1(6.47,27.79) v1(6.63,37.95) v1(6.78,43.21) v1(7.4,48.21) v1(7.35,26.86) v1(7.68,55.87) v1(8.31,53.15) v1(8.31,22.3) v1(8.33,0.56) v1(8.84,54.92) v1(8.89,51.47) v1(8.94,40.67) v1(9.45,7.95) v1(9.68,60.69) v1(10.16,66.04) v1(10.16,45.72) v1(10.16,15.24) v1(10.16,10.16) v1(10.29,6.94) v1(10.51,61.38) v1(10.51,60.69) v1(11.02,2.96) v1(11.09,0.57) v1(12.06,31.04) v1(12.7,81.28) v1(12.7,76.2) v1(12.7,71.12) v1(13.11,2.87) v1(13.14,0.58) v1(13.36,54.92) v1(14.25,44.88) v1(16.23,34.34) v1(16.26,39.52) v1(16.62,40.44) v1(17.07,15.24) v1(17.78,81.28) v1(17.78,76.2) v1(17.78,71.12) v1(17.78,66.04) v1(17.78,60.96) v1(19.43,41.28) v1(19.51,42.37) v1(20.32,30.48) v1(20.32,25.4) v1(20.32,20.32) v1(21.54,3.81) v1(21.49,1.8) v1(21.92,11.33) v1(22.66,2.9) v1(22.83,0.68) v1(22.86,81.28) v1(22.86,76.2) v1(22.86,71.12) v1(22.86,66.09) v1(22.86,60.96) v1(23.29,12.78) v1(23.32,10.06) v1(25.4,40.64) v1(25.4,35.56) v1(25.4,25.4) v1(25.4,20.32) v1(26.59,3.3) v1(26.59,2.11) v1(27.94,81.28) v1(27.94,76.2) v1(27.94,71.12) v1(27.94,66.04) v1(27.94,60.96) v1(27.94,30.47) v1(29.41,14.55) v1(29.82,13.51) v1(30.48,40.64) v1(30.48,35.56) v1(31.72,12.65) v1(33.02,81.28) v1(33.02,76.2) v1(33.02,71.12) v1(33.02,66.04) v1(33.93,12.6) v1(33.89,11) v1(34.18,28.11) v1(34.16,22.99) v1(34.31,13.57) v1(35.23,8.61) v1(35.33,59.18) v1(35.28,12.96) v1(35.36,28.15) v1(35.36,23.04) v1(35.56,15.24) v1(36.58,57.07) v1(36.61,54.05) v1(36.58,28.14) v1(36.55,26.37) v1(36.57,10.96) v1(36.66,12.5) v1(37.02,2.25) v1(37.01,0.87) v1(37.77,59.18) v1(38.18,28.16) v1(38.16,26.37) v1(38.35,30.49) v1(38.56,23.06) v1(38.96,57.12) v1(39.14,74.9) v1(39.41,7.23) v1(39.42,2.27) v1(39.45,0.87) v1(39.93,8.94) v1(40.16,28.19) v1(40.25,15.44) v1(40.64,76.2) v1(40.64,71.12) v1(40.64,66.04) v1(40.64,40.64) v1(40.64,35.56) v1(41.22,54.05) v1(41.38,57.05) v1(42.38,1.98) v1(42.57,23.04) v1(42.73,15.43) v1(42.8,74.93) v1(42.78,25.72) v1(43.03,12.26) v1(43.21,59.31) v1(43.28,60.14) v1(44.35,78.61) v1(44.3,74.96) v1(44.55,23.04) v1(45.12,11.16) v1(45.35,13.39) v1(45.72,71.12) v1(45.72,40.64) v1(45.72,35.56) v1(45.76,28.15) v1(46.38,68.96) v1(46.94,28.15) v1(46.94,23.01) v1(47.14,69.01) v1(47.19,64.06) v1(47.36,18.2) v1(47.52,21.69) v1(47.74,2.72) v1(48.16,22.99) v1(48.23,13.75) v1(48.53,28.17) v1(48.54,26.43) v1(49.45,2) v1(49.88,11.54) v1(49.9,10.6) v1(49.91,9.87) v1(50.54,4.33) v1(50.8,30.48) v1(50.85,10.6) v1(51.39,18.88) v1(51.66,11.49) v1(51.65,10.63) v1(51.66,9.82) v1(52.1,78.66) v1(52.85,35.5) v1(52.91,56.82) v1(52.89,42.42) v1(53.33,26.46) v1(53.6,56.82) v1(53.55,8.16) v1(53.7,72.75) v1(55.88,60.96) v1(55.88,55.88) v1(55.88,50.8) v1(55.88,45.72) v1(55.88,30.48) v1(55.98,74.85) v1(56.11,19.9) v1(57.07,13.27) v1(57.22,10.49) v1(57.46,72.14) v1(57.87,5.24) v1(58.06,72.16) v1(58.62,20.22) v1(58.91,17.77) v1(59.36,20.24) v1(60.96,71.12) v1(60.96,60.96) v1(60.96,55.88) v1(60.96,50.8) v1(60.96,40.64) v1(60.96,35.56) v1(61.49,2.9) v1(61.51,1.81) v1(62.13,3.94) v1(63.54,3.96) v1(65,3.91) v1(65.54,1.81) v1(65.57,3.04) v1(66.04,60.96) v1(66.04,55.88) v1(66.04,45.72) v1(66.04,40.64) v1(66.04,35.56) v1(66.04,5.08) v1(66.19,63.91) v1(67.72,78.23) v1(67.82,75.72) v1(67.77,62.81) v1(68.06,71.97) v1(69.49,76.96) v1(74.27,48.67) v1(74.82,33.95) v1(75.01,14.33) v1(75.16,53.31) v1(75.36,52.2) v1(75.95,32.94) v1(75.94,24.04) v1(75.97,40.59) v1(76.2,81.28) v1(76.2,76.2) v1(76.2,71.12) v1(76.2,66.04) v1(76.2,45.72) v1(76.42,14.36) v1(76.61,51.92) v1(77.78,14.22) v1(77.93,52.12) v1(78,76.91) v1(78.03,63.96) v1(78.07,53.25) v1(78.51,15.21) v1(78.74,45.21) v1(78.74,10.16) v1(78.74,5.08) v1(79.1,48.69) v1(79.07,37.31) v1(79.4,30.43) v1(79.41,28.22) v1(79.38,21.46) v1(79.71,75.79) v1(79.73,62.69) v1(79.78,78.21) v1(79.76,65.1) v1(79.76,45.21) v1(79.78,37.31) v1(80.24,30.45) v1(80.25,28.25) v1(80.26,21.44) v1(80.47,37.29)
VBAT: length 21.6
  Top Layer w0.406: U11.14 U11.13
  Top Layer w0.762: U11.13 52.03,12.65 53.51,12.65
  Top Layer w1.016: BATTERY3.7v1.1 58.92,14.15 C16.2 54.44,12.65 53.51,12.65
VCC_1V8: length 0.4
  Top Layer w0.152: 51.35,27.32 51.75,27.32
VCC_3V3: length 294.6
  Top Layer w0.152: 50.55,27.32 50.95,27.32 ; R42.2 42.01,21.11 41.71,20.8 34.98,20.8 33.64,22.14 33.64,28.79 34.54,29.69 R41.2 49.19,29.69 v1(50.81,28.07)
  Top Layer w0.305: SW_SLEEP/WAKE.4 78.26,23.16 v1(76.95,23.16) 71.4,23.16 62.81,31.75 LED_SIM_STATUS1.1 59.81,74.05 59.81,75.65 58.86,76.59 54.72,76.59 52.88,74.75 52.88,71.36 R27.1 51.16,69.64 37.94,69.64 26.17,57.87 R30.2 ; v1(50.81,28.07) 50.56,27.82 50.56,27.32 ; v1(76.91,39.83) 78.26,39.83 SW_VOlUME_UP.4 ; SW_VOLUME_DOWN.4 78.18,32.02 v1(76.92,32.02) ; Mic_switch.3 8.35,4.02 v1(8.93,4.02)
  Top Layer w0.457: v1(72.93,18.23) 63.09,28.07 v1(50.81,28.07)
  Bottom Layer w0.305: v1(76.91,39.83) 76.91,32.03 v1(76.92,32.02) 76.92,23.19
  Bottom Layer w0.457: v1(76.95,23.16) 77.05,23.06 77.05,22.3 72.98,18.24 72.98,7.67 66.16,0.85 41.91,0.85 38.01,4.75 9.67,4.75 v1(8.93,4.02)
BTST: length 2.1
  Top Layer w0.254: U11.21 48.85,10.99 48.25,10.99 47.54,11.7 C18.2
CARD_DETECT: length 30.8
  Top Layer w0.152: 66.34,72.9 66.35,72.92 66.35,75.43 64.53,77.25 43.5,77.25 41.05,79.71 41.05,80.94
CE: length 4.6
  Top Layer w0.152: U11.9 53.73,10.48 55.03,9.18 55.03,8.76 55.35,8.44 R38.1
GPIO0_D0(UART2_RX_M0): length 44.6
  Top Layer w0.152: JP1.51 44.15,26.49 v1(44.23,26.56) ; v1(72.79,53.76) 73.88,53.76 R26.1
  Bottom Layer w0.152: v1(72.79,53.76) 69.43,53.76 44.23,28.55 v1(44.23,26.56)
GPIO0_D1(UART2_TX_M0): length 47.6
  Top Layer w0.152: v1(72.8,57.1) 72.83,57.1 72.84,57.11 R25.1 ; 44.96,24.12 44.96,24.12 v1(44.96,26.06)
  Bottom Layer w0.152: v1(44.96,26.06) 44.95,26.04 44.07,26.04 43.75,26.36 43.75,28.81 72.04,57.1 v1(72.8,57.1)
GPIO3_D1: length 45.9
  Top Layer w0.152: v1(38.87,25.16) 38.95,25.16 38.96,25.15 38.96,24.12 JP1.25 ; R14.2 75.91,35.42 v1(74.66,35.42)
  Top Layer w0.305: 78.27,35.45 R14.2
  Bottom Layer w0.152: v1(74.66,35.42) 74.4,35.42 63.84,24.85 42.54,24.85 41.25,26.14 39.82,26.14 38.87,25.19 v1(38.87,25.16)
GPIO3_D2: length 49.4
  Top Layer w0.152: JP1.27 39.35,26.38 v1(39.28,26.45) ; v1(74.87,43.15) 74.89,43.17 R20.2
  Top Layer w0.305: SW_VOlUME_UP.3 R20.2
  Bottom Layer w0.152: v1(74.87,43.15) 56.82,25.11 42.64,25.11 41.3,26.45 v1(39.28,26.45)
GPIO3_D5: length 42.7
  Top Layer w0.152: v1(39.83,25.47) 39.75,25.39 JP1.29 ; R21.2 74.62,26.51 v1(74.59,26.49)
  Top Layer w0.305: SW_SLEEP/WAKE.3 75.95,26.52
  Bottom Layer w0.152: v1(39.83,25.47) 40.34,25.47 40.75,25.88 41.15,25.88 42.43,24.59 67.8,24.59 71.29,28.09 73.01,28.09 74.59,26.5 v1(74.59,26.49)
HDMI_CEC_PORT: length 48.9
  Top Layer w0.152: JP2.51 44.15,57.35 42.77,55.96 8.41,55.96 7.59,56.77 4.47,56.77 ; 4.47,56.78 4.47,57.87 R30.1 ; 4.47,56.78 4.47,56.77 4.47,56.77 ; 4.47,56.78 4.47,56.77 ; 4.47,56.77 v1(4.48,56.77) ; U10.14 5,53.27 v1(4.52,53.75)
  Bottom Layer w0.152: v1(4.48,56.77) 4.48,56.62 4.52,56.58 v1(4.52,53.75)
HDMI_TX0_N: length 58.3
  Top Layer w0.152: v1(50.57,60.42) 50.55,60.44 JP2.84 ; 10.06,50.98 8.77,52.27 7.49,52.27
  Top Layer w0.508: v1(49.47,51.15) 49.31,50.98 35.95,50.98 35.59,50.62 35.59,50.42 35.23,50.06 34.93,50.06 34.57,50.42 34.57,50.62 34.21,50.98 33.92,50.98 33.56,50.62 33.56,50.42 33.2,50.06 32.9,50.06 32.54,50.42 32.54,50.62 32.18,50.98 31.88,50.98 31.52,50.62 31.52,50.42 31.16,50.06 30.87,50.06 30.51,50.42 30.51,50.62 30.15,50.98 29.85,50.98 29.49,50.62 29.49,50.42 29.13,50.06 28.84,50.06 28.48,50.42 28.48,50.62 28.12,50.98 27.82,50.98 27.46,50.62 27.46,50.42 27.1,50.06 26.8,50.06 26.44,50.42 26.44,50.62 26.09,50.98 10.06,50.98
  Bottom Layer w0.508: v1(50.57,60.42) 50.57,51.97 49.76,51.15 v1(49.47,51.15)
HDMI_TX0_P: length 58.2
  Top Layer w0.152: U10.8 3.86,52.07 v1(3.79,52) ; JP2.82 50.15,60.68 49.89,60.42 v1(49.91,60.4)
  Top Layer w0.508: v1(49.48,51.81) 48.76,51.81 48.59,51.64 10.37,51.64 v1(10.32,51.69)
  Bottom Layer w0.152: v1(3.79,52) 3.84,51.94 4.53,51.94 4.6,52.02 9.99,52.02 v1(10.32,51.69)
  Bottom Layer w0.508: v1(49.91,60.4) 49.91,52.24 v1(49.48,51.81)
HDMI_TX1_N: length 59.1
  Top Layer w0.152: v1(48.86,59.06) 48.86,59.8 49.34,60.28 49.34,61.24 JP2.78 ; v1(4.8,51.54) 4.93,51.67 U10.6
  Top Layer w0.508: v1(47.5,48.44) 11,48.44
  Bottom Layer w0.152: v1(4.8,51.54) 7.77,51.54 v1(10.87,48.43)
  Bottom Layer w0.508: v1(48.86,59.06) 48.74,58.93 48.74,49.53 47.71,48.5 47.56,48.5 v1(47.5,48.44)
HDMI_TX1_P: length 59.1
  Top Layer w0.152: 9.44,50.23 8.21,51.47 7.49,51.47 ; v1(48.03,59.03) 48.03,59.4 48.94,60.31 48.94,61.24 JP2.76
  Top Layer w0.508: 47.4,49.1 44.18,49.1 43.82,49.46 43.82,49.83 43.46,50.19 43.16,50.19 42.8,49.83 42.8,49.46 42.44,49.1 42.14,49.1 41.79,49.46 41.79,49.83 41.43,50.19 41.13,50.19 40.77,49.83 40.77,49.46 40.41,49.1 40.11,49.1 39.75,49.46 39.75,49.83 39.39,50.19 39.1,50.19 38.74,49.83 38.74,49.46 38.38,49.1 38.08,49.1 37.72,49.46 37.72,49.83 37.36,50.19 37.06,50.19 36.71,49.83 36.71,49.46 36.35,49.1 10.39,49.1 9.35,50.14
  Bottom Layer w0.508: 47.44,49.16 48.08,49.8 48.08,58.98 v1(48.03,59.03)
  vias: v1(47.44,49.16)
HDMI_TX2_N: length 57
  Top Layer w0.152: JP2.72 48.15,60.75 46.83,59.43 46.88,59.43 v1(46.98,59.33) ; 8.34,48.25 7.87,48.71 7.87,49.66 8.19,49.97 8.19,51 8.13,51.07 7.49,51.07
  Top Layer w0.508: v1(44.88,46.83) 44.12,46.83 44.08,46.88 9.71,46.88 8.34,48.25
  Bottom Layer w0.508: 46.98,59.33 46.94,59.33 46.85,59.24 46.85,59.2 46.43,58.78 46.43,48.2 46.34,48.11 46.34,48.1 45.07,46.83 v1(44.88,46.83)
HDMI_TX2_P: length 57
  Top Layer w0.152: JP2.70 47.78,61.23 47.78,60.9 46.31,59.44 46.22,59.44 v1(46.19,59.47) ; v1(5.42,50.6) 5.69,50.87 U10.2
  Top Layer w0.508: v1(8.57,49.53) 8.57,48.95 9.98,47.54 44.07,47.54 44.11,47.58 v1(44.88,47.58)
  Bottom Layer w0.152: v1(8.57,49.53) 8.01,49.53 6.93,50.6 v1(5.42,50.6)
  Bottom Layer w0.508: v1(44.88,47.58) 45.77,48.48 45.77,59.05 v1(46.19,59.47)
HDMI_TX_HPD_PORT: length 39.4
  Top Layer w0.152: 7.49,54.27 7.49,54.72 8.36,55.59 42.88,55.59 44.55,57.26 JP2.53
HDMI_TXCLK_N: length 56.8
  Top Layer w0.152: JP2.90 51.76,61.24 51.76,59.75 v1(51.96,59.55) ; v1(4.26,52.97) 4.29,52.94 6.2,52.94 U10.12
  Top Layer w0.508: v1(9.19,52.61) 9.45,52.35 48.15,52.35 51.99,56.19 51.99,57.25 v1(51.97,57.27)
  Bottom Layer w0.152: v1(9.19,52.61) 6.83,52.61 6.47,52.97 v1(4.26,52.97)
  Bottom Layer w0.508: v1(51.96,59.55) 51.97,59.54 v1(51.97,57.27)
HDMI_TXCLK_P: length 56.7
  Top Layer w0.152: 9.66,53.09 8.95,53.09 8.52,52.67 7.49,52.67 ; JP2.88 51.38,61.23 51.38,60.32 51.39,60.31 51.39,59.86 51.27,59.74 v1(51.27,59.53)
  Top Layer w0.508: 9.66,53.09 9.66,53.07 9.72,53.01 26.86,53.01 27.22,53.37 27.22,53.87 27.58,54.23 27.88,54.23 28.24,53.87 28.24,53.37 28.6,53.01 28.89,53.01 29.25,53.37 29.25,53.87 29.61,54.23 29.91,54.23 30.27,53.87 30.27,53.37 30.63,53.01 30.93,53.01 31.28,53.37 31.28,53.87 31.64,54.23 31.94,54.23 32.3,53.87 32.3,53.37 32.66,53.01 32.96,53.01 33.32,53.37 33.32,53.87 33.68,54.23 33.97,54.23 34.33,53.87 34.33,53.37 34.69,53.01 47.88,53.01 51.31,56.44 v1(51.31,57.3)
  Bottom Layer w0.508: v1(51.31,57.3) 51.31,59.27 51.3,59.28 51.3,59.5 v1(51.27,59.53)
HDMI_TXDDC_SCL_PORT: length 51.2
  Top Layer w0.152: v1(53.75,61.93) 53.75,61.51 53.75,61.51 JP2.100 ; v1(24.98,54.23) 8.69,54.23 8.15,53.69 8.15,53.67 8.01,53.54 8,53.54 7.93,53.47 7.49,53.47
  Bottom Layer w0.152: v1(53.75,61.93) 52.89,62.79 33.97,62.79 25.41,54.23 v1(24.98,54.23)
HDMI_TXDDC_SDA_PORT: length 55.6
  Top Layer w0.152: JP2.99 53.75,58.06 v1(53.75,58.96) ; v1(5.21,53.75) 5.22,53.74 5.22,53.67 U10.16 ; v1(9.39,53.75) v1(25.51,53.75)
  Bottom Layer w0.152: v1(25.51,53.75) 34.16,62.4 50.31,62.4 v1(53.75,58.96) ; v1(5.21,53.75) v1(9.39,53.75)
HP_SNS: length 76.7
  Top Layer w0.152: JP3.8 49.16,43.68 75.09,17.74 75.09,17.01 ; 75.09,17.01 75.08,17.02 v1(75.08,17.59) ; 75.09,17.01 R3.2
  Bottom Layer w0.152: v1(75.08,17.59) 79.28,13.39 U9.1
HPL_OUT: length 76.9
  Top Layer w0.152: U9.2 75.79,12.42 75.79,17.59 ; R2.2 76.39,16.05 76.4,16.04 76.4,16.06 R2.2 ; R2.2 76.39,16.99 75.79,17.59 ; 75.79,17.59 49.3,44.08 JP3.6
HPR_OUT: length 109.5
  Top Layer w0.124: JP3.4 18.17,44.45 19.12,44.45 19.15,44.48 ; v1(19.25,44.56) 19.22,44.53 19.22,44.48 ; v1(17.15,29.21) 16.83,28.89 10.02,28.89
  Top Layer w0.152: 77.1,16.75 49.38,44.48 JP3.4 ; 77.1,16.75 77.1,11.22 76.02,10.14 76.02,5.31 U9.3 ; 77.1,16.75 R1.2
  Bottom Layer w0.124: v1(19.25,44.56) 19.25,43.86 17.15,41.76 v1(17.15,29.21)
ILIM: length 4
  Top Layer w0.152: U11.10 54.2,10.98 55.39,9.78 R33.2
LED1#: length 10.6
  Top Layer w0.152: 54.55,80.94 54.55,79.81 54.79,79.57 62.47,79.57 62.74,79.3 62.74,78.24
MIC1_IN: length 126.4
  Top Layer w0.124: 1.57,14.93 1.89,14.62 2.1,14.62 2.22,14.74 3.98,14.74 v1(17.75,28.5) ; 19.19,43.28 19.19,43.25 v1(19.24,43.2)
  Top Layer w0.152: R9.1 R4.1 1.57,10.57 MIC_INPUT.1 ; U9.4 74.31,7.5 73.75,8.06 73.75,18.59 49.06,43.28 JP3.10
  Bottom Layer w0.124: v1(19.24,43.2) 17.76,41.72 17.76,28.52 v1(17.75,28.5)
MIPI_CSI_RX_D2N: length 3.7
  Top Layer w0.152: JP2.33 40.55,59.11 39.35,60.31 JP2.28
MIPI_CSI_RX_D2P: length 3.7
  Top Layer w0.152: JP2.35 40.95,59.14 39.75,60.34 JP2.30
MIPI_CSI_RX_D3N: length 3.7
  Top Layer w0.152: JP2.39 41.74,58.07 41.74,59.17 40.55,60.36 JP2.34
MIPI_CSI_RX_D3P: length 3.7
  Top Layer w0.152: JP2.36 40.95,60.5 42.11,59.35 42.11,59.35 42.15,59.3 JP2.41
OTG: length 5.3
  Top Layer w0.152: U11.8 53.75,9.98 53.94,9.78 53.94,8.67 55.47,7.14 R37.2
PMIC_PWRON: length 2.9
  Top Layer w0.152: JP1.99 53.75,21.2 53.77,21.19
REGN: length 10.8
  Top Layer w0.152: R34.2 55.79,12.01 v1(55.35,12.01)
  Top Layer w0.254: U11.22 48,10.48 v1(47.96,10.43) 47.17,10.43 C15.2
  Bottom Layer w0.152: v1(55.35,12.01) 50.1,12.01 50.08,12.02 49.68,12.02 49.66,12.01 49.53,12.01 v1(47.96,10.43)
SARADC_VIN1: length 57.2
  Top Layer w0.152: 47.75,27.32 47.75,25.7 v1(47.74,25.68) ; v1(5.47,5.09) 5.47,5.81 R4.2 5.42,5.86 4.06,5.86 4.05,5.85 C5.2
  Bottom Layer w0.152: v1(5.47,5.09) 5.67,5.29 13.92,5.29 35.56,26.93 42.77,26.93 44.12,25.58 47.63,25.58 v1(47.74,25.68)
SCL: length 26.7
  Top Layer w0.152: U11.5 51.52,8.46 51.69,8.29 51.69,8.26 v1(51.93,8.03) ; JP1.35 40.95,24.11 40.95,23.5 41.11,23.34 v1(41.11,22.67) 41.15,22.63 R42.1
  Bottom Layer w0.152: v1(51.93,8.03) 51.93,8.05 50.92,9.06 43.98,9.06 42.95,10.09 42.95,10.71 41.11,12.55 v1(41.11,22.67)
SDA: length 29.5
  Top Layer w0.152: v1(40.95,25.4) 40.95,27.31 40.95,27.32 40.95,28.27 40.95,28.28 40.95,28.43 41.05,28.52 R41.1 ; v1(52.54,8.83) 52.53,8.81 U11.6
  Bottom Layer w0.152: v1(40.95,25.4) 41.82,24.53 41.82,12.47 44.98,9.31 51.03,9.31 51.08,9.26 52.11,9.26 v1(52.54,8.83)
SPEAKER+: length 6
  Top Layer w0.305: SPEAKER.1 1.57,34 6.28,34 6.66,34.38 U1.8
SPEAKER-: length 12.1
  Top Layer w0.305: SPEAKER.2 3.49,29.43 7.6,33.53 8.28,33.53 8.61,33.86 ; 8.61,33.86 8.93,33.55 10.18,33.55 R11.1 ; 8.61,33.86 U1.5
STATUS: length 11.9
  Top Layer w0.152: U11.4 51.02,8.28 v1(51.21,8.09) ; CHRG.1 42.23,10.45 v1(42.37,10.31)
  Bottom Layer w0.152: v1(42.37,10.31) 43.88,8.81 50.5,8.81 v1(51.21,8.09)
SW: length 7.2
  Top Layer w0.254: U11.20 U11.19 ; C18.1 45.97,12.69 46.59,13.31
  Top Layer w0.61: 46.59,13.7 L1.1
  Top Layer w0.762: U11.19 48.59,11.98 47.89,12.67 47.35,12.67 46.59,13.44 46.59,13.7
SYS: length 136
  Top Layer w0.152: v1(57.7,7.19) 57.65,7.14 57.02,7.14
  Top Layer w0.254: v1(39.36,82.13) 39.52,81.97 39.55,81.97 ; U11.15 U11.16 ; 39.55,80.94 39.55,81.96
  Top Layer w0.305: 56.05,80.94 56.5,80.94 ; 39.55,80.94 38.55,80.94
  Top Layer w0.508: v1(38.74,82.02) 38.74,81.13 38.55,80.94
  Top Layer w0.762: 50.77,12.64 50.77,15.22 L1.2
  Top Layer w1.016: 56.5,80.94 56.69,80.75 ; 56.36,81.66 56.58,81.88 57.57,81.87 ; v1(71.6,24.41) 71.6,24.71 71.58,24.74 v1(71.58,25.45) v1(71.58,26.45) 71.58,27.03 ; 57.78,81.86 v1(60.14,81.86) 60.73,81.86 60.75,81.84 67.76,81.84 71.56,78.03 71.56,27.41
  Bottom Layer w0.152: v1(57.7,7.19) 57.7,14.21 57.65,14.26
  Bottom Layer w1.016: 66.27,16.79 61.75,16.79 59.22,14.26 52.24,14.26 ; 60.11,81.84 v1(59.15,81.84) v1(58.13,81.84) 38.91,81.84 v1(38.74,82.02) ; 66.54,16.82 66.58,16.87 69.47,16.87 71.56,18.96 71.56,25.55 71.58,25.56 v1(71.58,26.45) v1(71.58,27.41)
  vias: v1(52.51,14.12) v1(53.37,14.13) v1(54.23,14.12)
TS: length 5.6
  Top Layer w0.152: 57,12.35 57,11.84 56.89,11.73 56.25,11.73 56.15,11.62 56.15,11.07 ; R35.2 55.54,11.07 55.13,11.48 U11.11
USB2_0_OTG_DM: length 49
  Top Layer w0.203: v1(34.24,57.06) 34.24,57.09 34.56,57.41 34.56,57.61 34.55,57.61 JP2.3
  Top Layer w0.508: USB2.2 30.74,13.51 D10.2 30.81,13.59 30.81,13.94 31.28,14.4 v1(31.28,25.56)
  Bottom Layer w0.508: 34.24,57.06 33.99,56.82 33.99,56.1 34.36,55.73 34.36,31.98 31.28,28.89 31.28,25.57
USB2_0_OTG_DP: length 48.9
  Top Layer w0.203: JP2.5 34.95,57.28 v1(35.15,57.08)
  Top Layer w0.508: v1(31.94,25.56) 31.94,15.05 32.8,14.19 D11.2 32.8,10.99 USB2.3
  Bottom Layer w0.508: v1(31.94,25.56) 31.94,28.62 35.02,31.71 35.02,56.2 35.15,56.32 v1(35.15,57.08)
USB2_DN: length 12.7
  Top Layer w0.152: v1(49.42,7.93) 49.54,7.8 USB1.5 49.54,6.93 49.54,6.11 50.28,5.38 50.5,5.38 52.33,3.55 D4.2
  Top Layer w0.254: USB1.7 v1(50.54,7.99) 50.54,8.8 U11.3
  Bottom Layer w0.152: v1(50.54,7.99) 50.47,7.93 v1(49.42,7.93)
USB2_DP: length 11
  Top Layer w0.152: 56.24,4.62 55.77,4.62 55.52,4.37 52.03,4.37 50.85,5.56 50.85,5.98
  Top Layer w0.254: U11.2 50.04,8.8 50.04,8.25 50.01,8.21 50.01,7.77 50.04,7.74 USB1.6 50.04,6.2 50.26,5.98 50.85,5.98 51.04,6.17 USB1.8
USB2_HOST2_N: length 39.6
  Top Layer w0.152: v1(14.5,43.59) 14.8,43.29 15.55,43.29 JP3.9
  Top Layer w0.305: 8.33,76.97 8.33,77.87
  Top Layer w0.508: 8.33,76.97 8.33,76.25 7.39,75.31 7.39,74.4 7.42,74.4 v1(7.68,74.13)
  Bottom Layer w0.508: v1(14.5,43.59) 14.49,43.57 13.14,43.57 11.68,45.04 11.68,70.07 7.68,74.06 v1(7.68,74.13)
USB2_HOST2_P: length 39.6
  Top Layer w0.152: JP3.11 14.48,42.88
  Top Layer w0.508: CN1.3 7.33,76.39 v1(7.34,76.38) ; 14.48,42.88 13.58,42.88 12.34,44.11 v1(12.34,45.95)
  Bottom Layer w0.508: v1(7.34,76.38) 7.34,75.41 v1(8.15,74.6) 12.34,70.41 v1(12.34,45.95)
USB3_HOST1_N: length 68.6
  Top Layer w0.152: CN2.9 54.8,73.38 54.8,72.23 54.58,72.01 ; 15.56,41.27 16.28,41.27 16.62,41.61 16.62,45.41
  Top Layer w0.508: 54.58,71.88 54.56,71.88 54.54,71.86 54.54,68.68 53.68,67.82 53.68,67.34 54.54,66.48 54.54,50.72 50,46.18 17.16,46.18 16.62,45.64 16.62,45.41
USB3_HOST1_P: length 68.6
  Top Layer w0.152: 17.33,45.42 17.01,45.09 17.01,41.54 16.34,40.88 JP3.21 ; CN2.7 55.3,72.06
  Top Layer w0.508: 55.3,72.06 55.3,71.32 55.22,71.24 55.22,50.44 50.19,45.42 17.45,45.42
USIM_CLK: length 34.8
  Top Layer w0.152: v1(63.43,65.6) CARD1.C3 ; D5.6 48.1,65.51 v1(49.03,65.51) ; 49.05,80.94 49.11,80.88 49.03,80.8 v1(49.03,79.77)
  Bottom Layer w0.152: 49.04,65.52 49.03,65.52 49.03,65.6 ; v1(49.03,79.77) 49.03,65.6 ; 49.03,65.6 v1(63.43,65.6) ; 49.03,65.6 48.16,65.6 D5.6
USIM_DATA: length 39.7
  Top Layer w0.152: v1(46.2,64.57) 46.2,65.62 46.09,65.73 ; v1(48.55,79.3) 48.55,80.94 48.55,80.94 ; v1(65.26,66.8) 66.32,66.8 CARD1.C7
  Bottom Layer w0.152: v1(65.26,66.8) 65.26,66.76 63.2,64.7 46.33,64.7 v1(46.2,64.57) 46.2,66.25 48.55,68.6 v1(48.55,79.3)
USIM_RST: length 35.1
  Top Layer w0.152: 49.55,80.94 49.55,80.36 49.51,80.32 v1(49.51,79.31) ; D5.3 46.16,67.79 46.16,67.32 46.42,67.07 49.45,67.07 v1(49.51,67.13) ; CARD1.C2 65.37,68.14 v1(65.31,68.08)
  Bottom Layer w0.152: v1(49.51,79.31) v1(49.51,67.13) 64.35,67.13 64.42,67.2 ; v1(65.31,68.08) 64.42,67.2
USIM_VDD: length 32.2
  Top Layer w0.152: D5.1 48.09,68.8 v1(48.07,68.82) 48.07,68.82 v1(50.24,68.82) ; v1(48.03,79.76) 48.05,79.77 48.05,80.94 ; CARD1.C1 66.39,70.68 v1(65.24,70.68)
  Bottom Layer w0.152: v1(65.24,70.68) 63.38,68.82 v1(50.24,68.82) ; v1(48.03,79.76) 48.07,79.73 v1(48.07,68.82)
V_USB: length 10.4
  Top Layer w0.406: C17.2 41.49,7.22 D1.2 ; 48.68,8.65 48.84,8.81 U11.1
  Top Layer w0.61: 48.68,8.65 48.52,8.49 44.97,8.49 F1.2 43.7,7.22 C17.2
$1N4419: length 2.8
  Top Layer w0.305: R25.2 76.32,58.62 H1.3
$1N4460: length 2.9
  Top Layer w0.305: H1.2 76.1,55.3 73.97,55.3 R26.2
$2N2: length 77.8
  Top Layer w0.152: v1(15.11,58.99) 15.11,64.55 9.33,70.33 CN1.1 ; Camera_Switch.2 18.67,4 CAMERA_ON.1 18.67,7.21 v1(16.7,9.17)
  Bottom Layer w0.152: v1(15.11,58.99) 15.11,10.76 v1(16.7,9.17)
$2N7: length 2.6
  Top Layer w0.152: C3.2 U1.2 U1.3
$2N10: length 5.1
  Top Layer w0.152: 10.31,32.55 9.16,32.55 8.61,32 U1.4 R10.2
$2N12: length 3.3
  Top Layer w0.152: 6.83,5.83 6.94,5.83 7.77,6.67 R8.1 8.39,6.67 9.22,5.84 C1.2
$2N528: length 1.5
  Top Layer w0.152: R10.1 8.61,27.8 10.02,27.8
$2N1557: length 2.4
  Top Layer w0.152: Mic_switch.2 8.14,5.31 R8.2
$3N6118: length 4.1
  Top Layer w0.152: RING_IND1.1 49.39,71.29 51.28,71.29 51.3,71.3 ; 51.3,71.3 R27.2 ; 51.3,71.3 CN2.23
$3N9431: length 3.7
  Top Layer w0.305: 62.84,73.04 62.74,73.14 62.74,76.67
$5N5817: length 8.2
  Top Layer w0.305: 6.27,54.07 5.67,54.07 5.32,54.42 5.31,54.42 4.5,55.24 4.5,55.8 3.39,56.91 3.38,56.91 1.5,58.78 1.5,59.93
$6N34185: length 1.3
  Top Layer w0.152: R36.1 41.24,11.69 CHRG.2
$6N55425: length 16
  Top Layer w0.406: USB1.11 52.69,7.98 v1(52.74,8.02) ; USB1.2 47.89,6.38 48.06,6.21 48.06,6.2 48.1,6.16 48.1,5.05 47.4,4.34
  Top Layer w0.61: v1(47.61,4.36) 48.1,4.86 48.1,5.05 ; 47.4,4.34 v1(46.96,4.34) F1.1
  Bottom Layer w0.406: v1(52.74,8.02) 52.54,7.83 52.54,7.78 52.18,7.42 52.13,7.42 49.07,4.36 v1(47.61,4.36) 46.96,4.36
$6N55448: length 7.8
  Top Layer w0.152: R32.2 45,2.69 45.62,3.31 47.33,3.31 49.04,5.02 USB1.4
$6N55522: length 6.2
  Top Layer w0.152: R31.2 55.1,4.82 52.83,4.82 52.04,5.61 USB1.10

## Copper pours and planes (outline as drawn; the poured copper is in the pictures)
GND on Top Layer: -0.38,83.87 -0.38,0.23 -0.38,0.22 81.31,0.22 81.44,0.36 81.44,83.92 81.36,84 -0.25,84
GND on Bottom Layer: 0.26,83.11 0.26,-0.53 0.27,-0.53 81.95,-0.53 82.08,-0.4 82.08,83.16 82,83.24 0.39,83.24
SYS on Top Layer: 55.91,16.82 56.16,16.56 56.16,14.83 54.98,13.66 49.1,13.66 48.92,13.84 48.92,16.73 49.01,16.82

## Text on the board
Bottom Silkscreen Layer: Thank you ER,CZ,FP,PC,PM,BP,BS,AF,AR<3,WN | OURphone v1.1
Top Silkscreen Layer: OFF | ON | M2_MODEM | HEADPHONE | UART_DEBUG | USB_WEBCAM | HDMI | + | - | Orange Pi CM4 | motherboard - receiving part
